# EAGLE board EPAPER73_V2 (EAGLE 9.7.0)
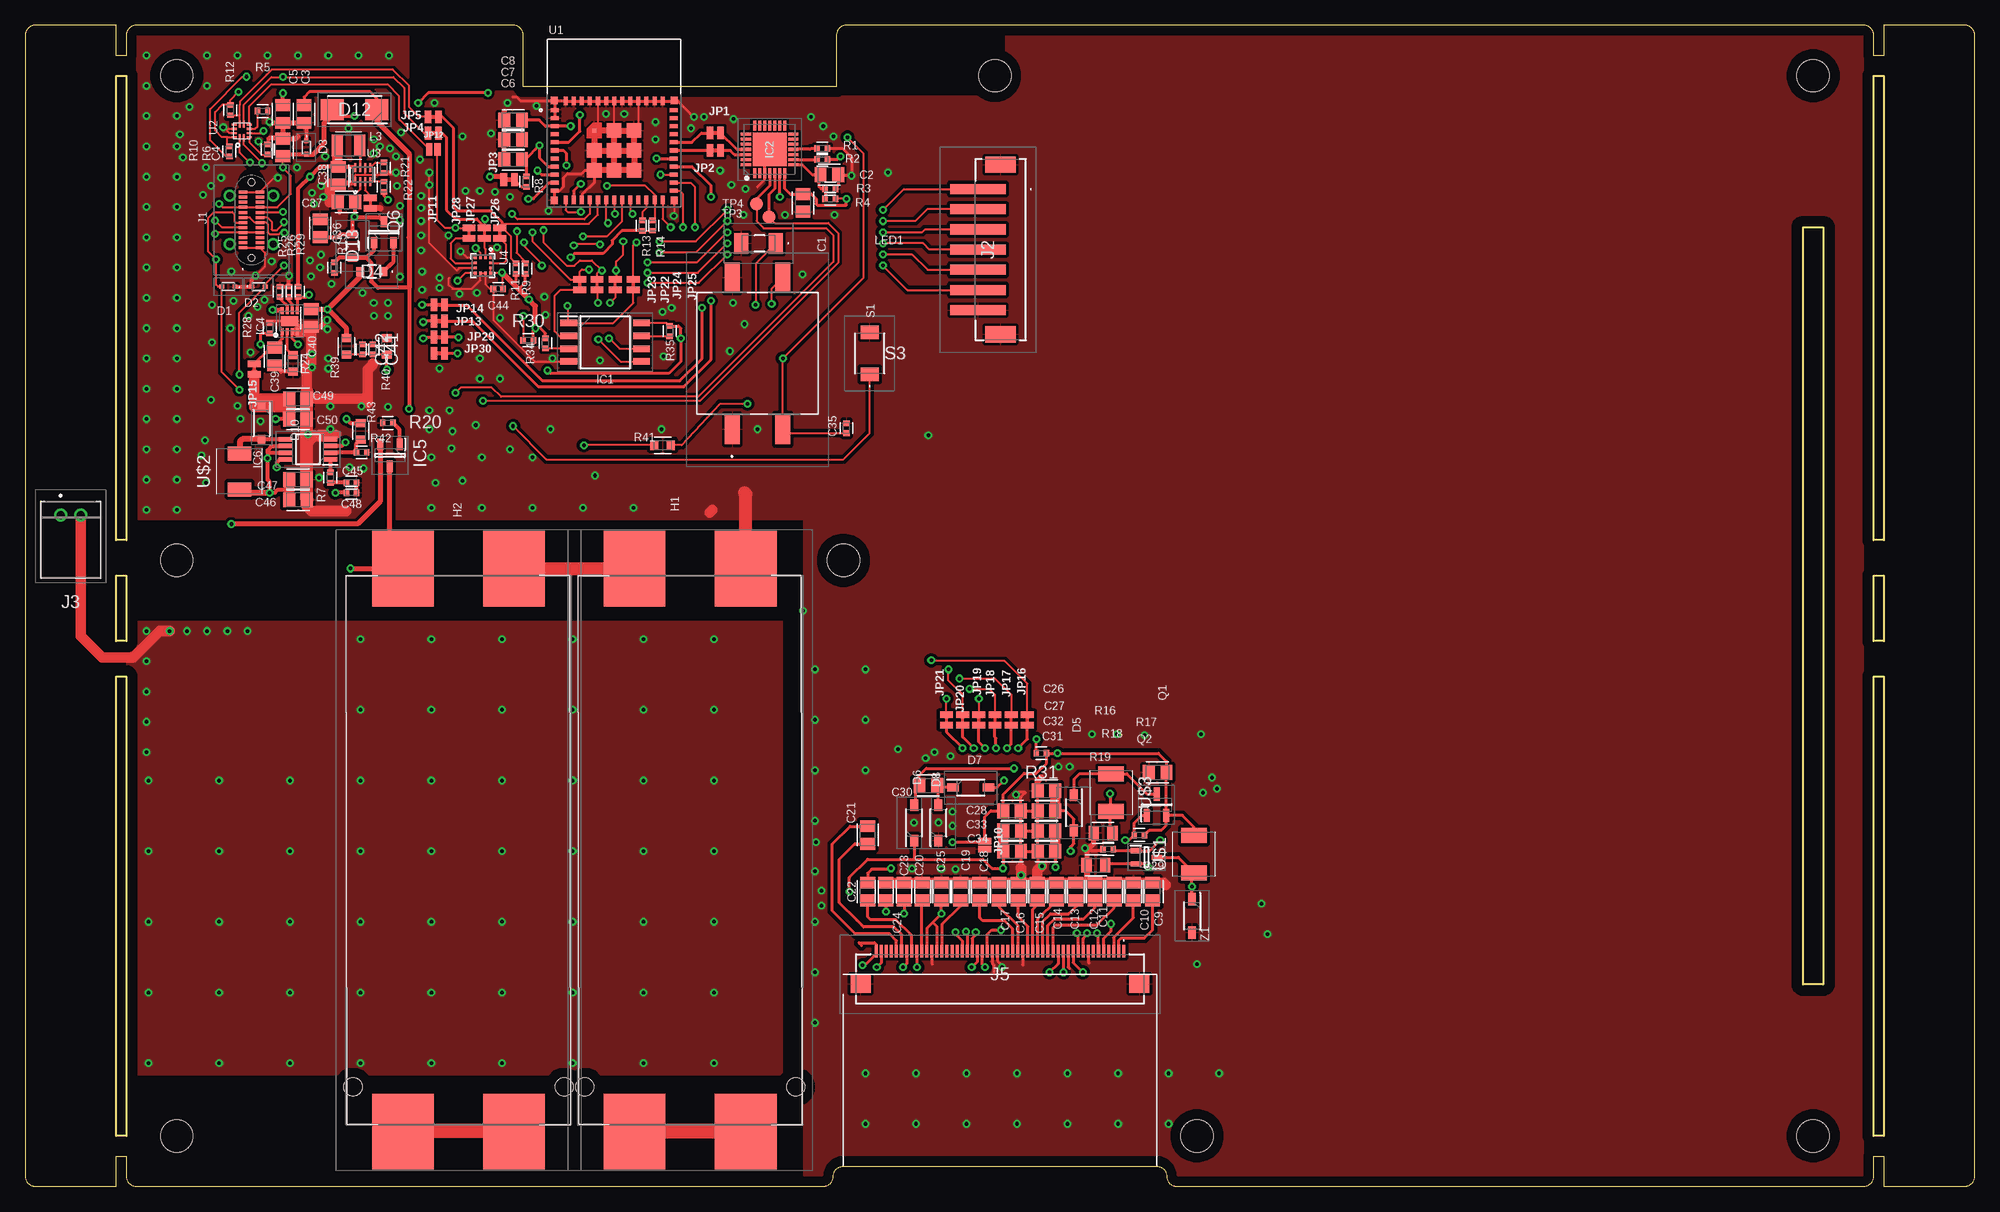
[diagram p2: board, top side]
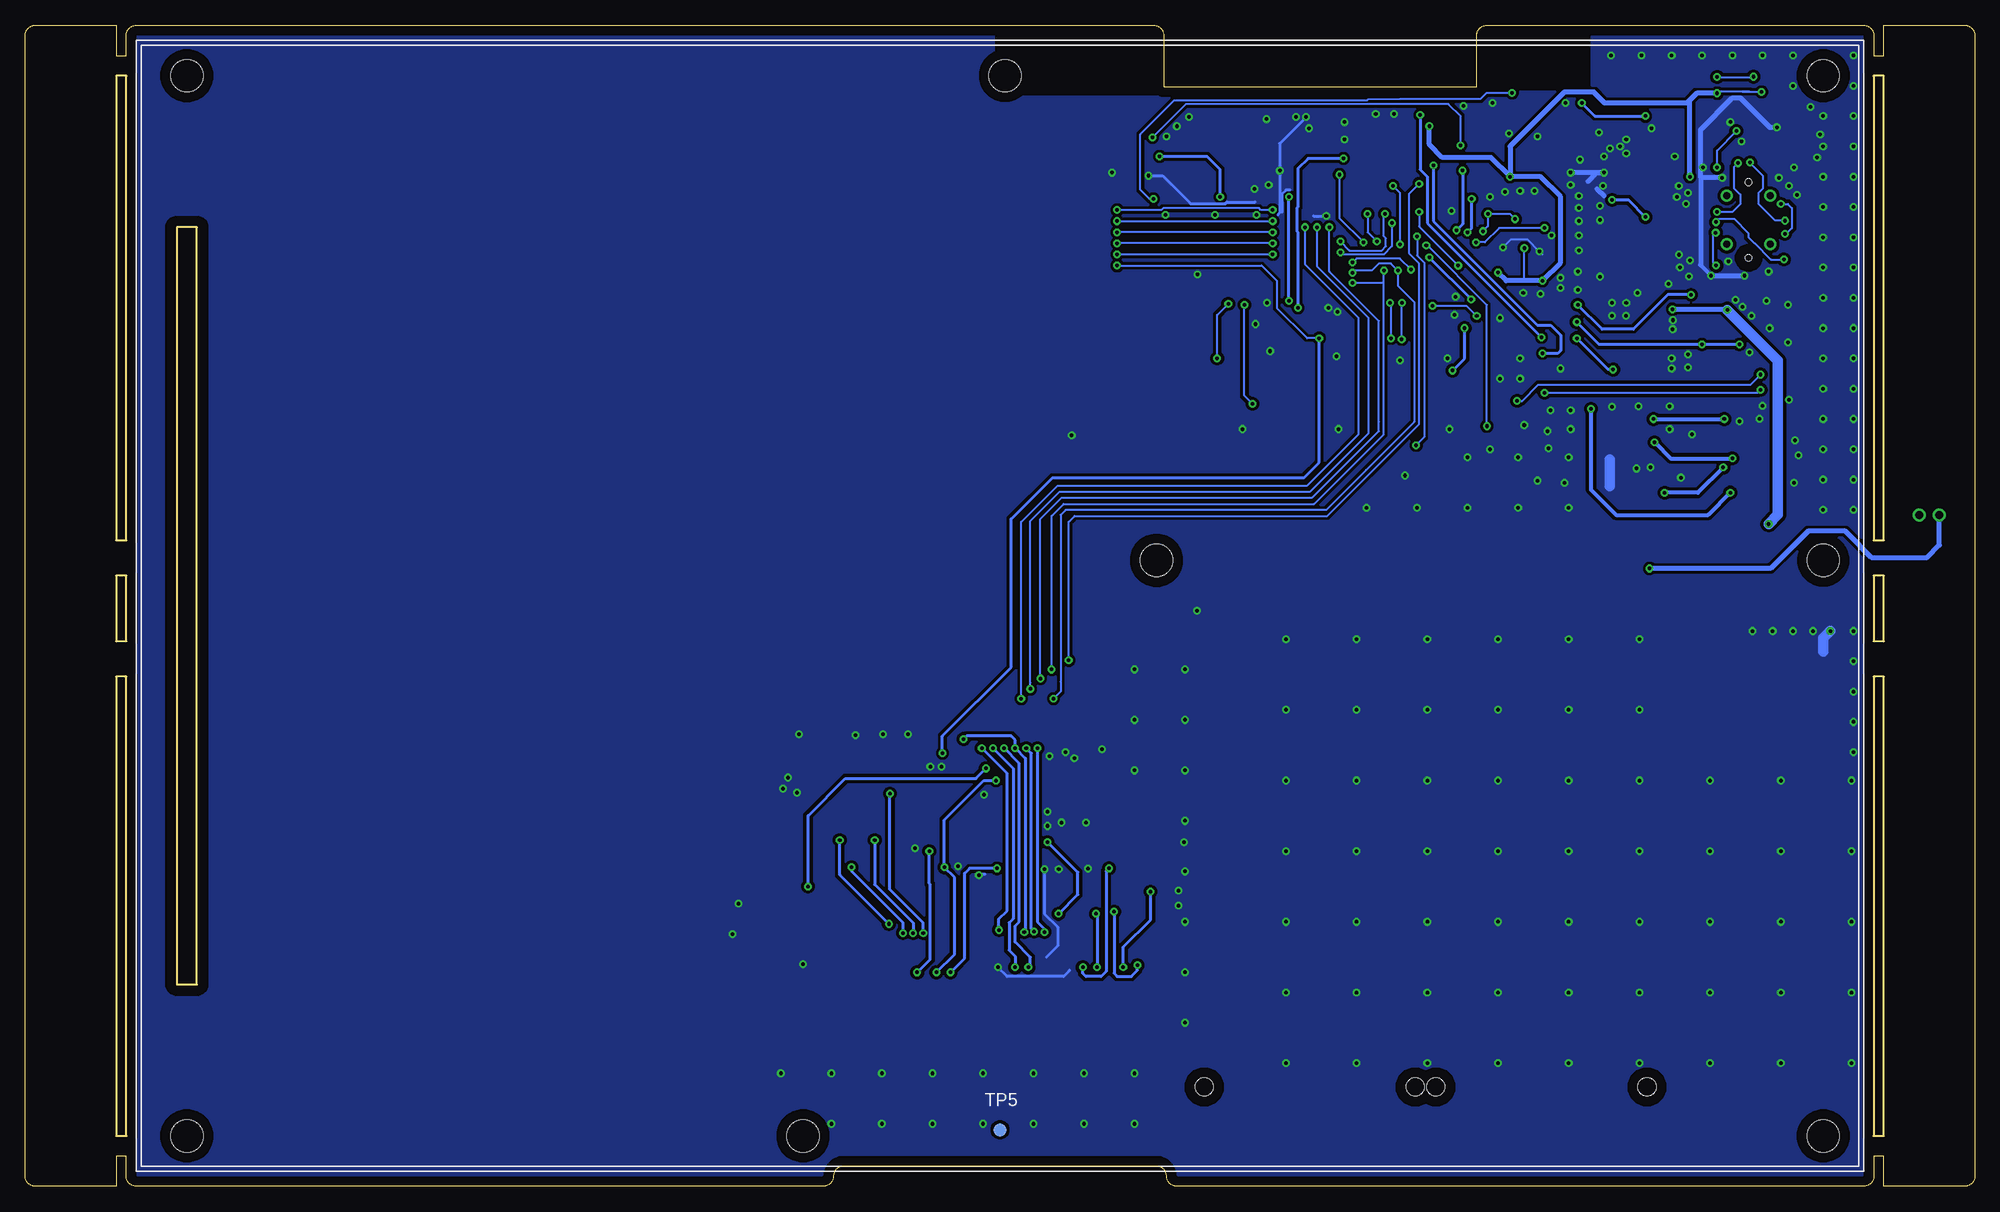
[diagram p3: board, bottom side, seen from below]

Size 193 x 115 mm. Coordinates in mm from the lower left corner, seen from the top.
Outline: 48.3,115 11,115 arc90 10,114 10,112 9,112 9,115 1,115 arc90 0,114 0,1 arc90 1,0 9,0 9,3 10,3 10,1 arc90 11,0 79,0 arc90 80,1 arc-90 81,2 112,2 arc-90 113,1 arc90 114,0 182,0 arc90 183,1 183,3 184,3 184,0 192,0 arc90 193,1 193,114 arc90 192,115 184,115 184,112 183,112 183,114 arc90 182,115 81.3,115 arc90 80.3,114 80.3,108.9 49.3,108.9 49.3,114 arc90 48.3,115
Outline: 10,110 10,64 9,64 9,110 10,110
Outline: 10,50.5 10,5 9,5 9,50.5 10,50.5
Outline: 9,54 9,60.5 10,60.5 10,54 9,54
Outline: 184,110 184,64 183,64 183,110 184,110
Outline: 184,50.5 184,5 183,5 183,50.5 184,50.5
Outline: 183,54 183,60.5 184,60.5 184,54 183,54
Outline: 178,95 178,20 176,20 176,95 178,95
Copper layers (1*16): Top / Bottom
Stack-up Default Layer Stack: Top User Defined 0.035mm / Dielectric-1 User Defined 1.5mm / Bottom User Defined 0.035mm
Design rules: minimum copper width 6mil, minimum drill size 0.35mm, copper clearance wire_polygon to wire_polygon 6mil, copper clearance wire_polygon to pad_smd 6mil, copper clearance wire_polygon to via 6mil, copper clearance pad_smd to pad_smd 6mil, copper clearance pad_smd to via 6mil, copper clearance via to via 6mil, copper clearance smd to pad (same net) 6mil, copper clearance smd to via (same net) 6mil, copper clearance smd to smd (same net) 6mil, dimension clearance 40mil, via restrict clearance 0mil, restrict clearance 0mil, drill distance 6mil, keepout clearance 0mil
Holes 3.2 mm at 15,110 15,5 177,5 177,110 81,62 116,5 96,110 15,62

## Footprints (pad centres in the part's own frame; a part is rotated, then mirrored left to right if it is on the bottom)
CAPC2012X110 = smd 1.165 x 1.465: 1 -0.875,0; 2 0.875,0
CAPC1005X60 = smd 0.56 x 0.629: 1 -0.485,0; 2 0.485,0
LESD5D50CT1G = smd 0.48 x 0.4: 1 -0.66,0; 2 0.66,0
CUS357H3F = smd 0.8 x 0.9: 1 -1.15,0; 2 1.15,0
SOD3716X135N = smd 1.15 x 0.8: 1 -1.75,0; 2 1.75,0
SODFL3516X120N = smd 0.82 x 0.76: 1 -1.6,0; 2 1.6,0
DIOM5327X244N = smd 2.3 x 2.05: 1 -2.2,0; 2 2.2,0
1078 = smd 7.45 x 6.1: 1 -27.875,-5.5; 2 -27.875,5.5; 3 27.875,-5.5; 4 27.875,5.5 | hole 1.8: -23.45,-10.45; -23.45,10.45
SOIC127P790X216-8N = smd 1.65 x 0.65: 1 -3.6,1.905; 2 -3.6,0.635; 3 -3.6,-0.635; 4 -3.6,-1.905; 5 3.6,-1.905; 6 3.6,-0.635; 7 3.6,0.635; 8 3.6,1.905
QFN50P500X500X80-29N = smd 1 x 0.3: 1 -2.35,1.5; 2 -2.35,1; 3 -2.35,0.5; 4 -2.35,0; 5 -2.35,-0.5; 6 -2.35,-1; 7 -2.35,-1.5; 15 2.35,-1.5; 16 2.35,-1; 17 2.35,-0.5; 18 2.35,0; 19 2.35,0.5; 20 2.35,1; 21 2.35,1.5 | smd 0.3 x 1: 8 -1.5,-2.35; 9 -1,-2.35; 10 -0.5,-2.35; 11 0,-2.35; 12 0.5,-2.35; 13 1,-2.35; 14 1.5,-2.35; 22 1.5,2.35; 23 1,2.35; 24 0.5,2.35; 25 0,2.35; 26 -0.5,2.35; 27 -1,2.35; 28 -1.5,2.35 | smd 3.35 x 3.35: 29 0,0
SON50P200X200X80-9N = smd 0.7 x 0.3: 1 -1.05,0.75; 2 -1.05,0.25; 3 -1.05,-0.25; 4 -1.05,-0.75; 5 1.05,-0.75; 6 1.05,-0.25; 7 1.05,0.25; 8 1.05,0.75 | smd 1 x 1.7: 9 0,0
SOT96P240X115-3N = smd 1.15 x 0.6: 1 -1.1,0.96; 2 -1.1,-0.96; 3 1.1,0
SOP65P490X110-8N = smd 1.4 x 0.45: 1 -2.2,0.975; 2 -2.2,0.325; 3 -2.2,-0.325; 4 -2.2,-0.975; 5 2.2,-0.975; 6 2.2,-0.325; 7 2.2,0.325; 8 2.2,0.975
U263241N4BQC02 = smd 0.3 x 0.85: A1 -2.75,0.835; A2 -2.25,0.835; A3 -1.75,0.835; A4 -1.25,0.835; A5 -0.75,0.835; A6 -0.25,0.835; A7 0.25,0.835; A8 0.75,0.835; A9 1.25,0.835; A10 1.75,0.835; A11 2.25,0.835; A12 2.75,0.835; B1 2.75,-0.835; B2 2.25,-0.835; B3 1.75,-0.835; B4 1.25,-0.835; B5 0.75,-0.835; B6 0.25,-0.835; B7 -0.25,-0.835; B8 -0.75,-0.835; B9 -1.25,-0.835; B10 -1.75,-0.835; B11 -2.25,-0.835; B12 -2.75,-0.835 | drill 0.7 pad 1.1: MH1 -2.4,2.15; MH2 2.4,2.15; MH3 2.4,-2.15; MH4 -2.4,-2.15 | hole 0.66: -3.75,0; 3.75,0
B7BPHSM4TBLFSN = smd 1 x 5.5: 1 6,2.75; 2 4,2.75; 3 2,2.75; 4 0,2.75; 5 -2,2.75; 6 -4,2.75; 7 -6,2.75 | smd 1.6 x 3: 8 8.4,0.5; 9 -8.4,0.5
S2BPHKS = drill 0.8 pad 1.3: 1 0,0; 2 -2,0
FPC05FB50PH20 = smd 0.3 x 1.2: 1 12.25,2.6; 2 11.75,2.6; 3 11.25,2.6; 4 10.75,2.6; 5 10.25,2.6; 6 9.75,2.6; 7 9.25,2.6; 8 8.75,2.6; 9 8.25,2.6; 10 7.75,2.6; 11 7.25,2.6; 12 6.75,2.6; 13 6.25,2.6; 14 5.75,2.6; 15 5.25,2.6; 16 4.75,2.6; 17 4.25,2.6; 18 3.75,2.6; 19 3.25,2.6; 20 2.75,2.6; 21 2.25,2.6; 22 1.75,2.6; 23 1.25,2.6; 24 0.75,2.6; 25 0.25,2.6; 26 -0.25,2.6; 27 -0.75,2.6; 28 -1.25,2.6; 29 -1.75,2.6; 30 -2.25,2.6; 31 -2.75,2.6; 32 -3.25,2.6; 33 -3.75,2.6; 34 -4.25,2.6; 35 -4.75,2.6; 36 -5.25,2.6; 37 -5.75,2.6; 38 -6.25,2.6; 39 -6.75,2.6; 40 -7.25,2.6; 41 -7.75,2.6; 42 -8.25,2.6; 43 -8.75,2.6; 44 -9.25,2.6; 45 -9.75,2.6; 46 -10.25,2.6; 47 -10.75,2.6; 48 -11.25,2.6; 49 -11.75,2.6; 50 -12.25,2.6 | smd 2 x 1.8: MP1 13.8,-0.65; MP2 -13.8,-0.65
SMT-JUMPER_2_NC_TRACE_NO-SILK = smd 0.66 x 1.27: 1 -0.521,0; 2 0.521,0
SMT-JUMPER_2_NO_NO-SILK = smd 0.635 x 1.27: 1 -0.406,0; 2 0.406,0
INDC2520X120N = smd 1.079 x 2.129: 1 -1.125,0; 2 1.125,0
KPTD3216SGC = smd 1.4 x 2: 1 -1.7,0; 2 1.7,0
SOT95P237X112-3N = smd 1.3 x 0.6: 1 -1.05,0.95; 2 -1.05,-0.95; 3 1.05,0
SOT65P210X110-3N = smd 1.05 x 0.5: 1 -1.05,0.65; 2 -1.05,-0.65; 3 1.05,0
SOT96P240X110-3N = smd 1.1 x 0.65: 1 -1.05,0.96; 2 -1.05,-0.96; 3 1.05,0
RESC1005X40 = smd 0.535 x 0.644: 1 -0.507,0; 2 0.507,0
RESC2012X65 = smd 1.031 x 1.42: 1 -0.919,0; 2 0.919,0
RESC1608X60 = smd 0.799 x 0.974: 1 -0.815,0; 2 0.815,0
TS1088AR02016 = smd 1.35 x 1.8: 1 -2.075,0; 2 2.075,0
TS1103SCU = smd 3 x 1.5: 1 -7.5,2.5; 2 7.5,2.5; 3 -7.5,-2.5; 4 7.5,-2.5
B1,27 = smd 1.27 x 1.27: TP 0,0
XCVR_ESP32-C6-MINI-1-N4 = smd 0.8 x 0.4: 1 -5.9,4; 2 -5.9,3.2; 3 -5.9,2.4; 4 -5.9,1.6; 5 -5.9,0.8; 6 -5.9,0; 7 -5.9,-0.8; 8 -5.9,-1.6; 9 -5.9,-2.4; 10 -5.9,-3.2; 11 -5.9,-4; 25 5.9,-4; 26 5.9,-3.2; 27 5.9,-2.4; 28 5.9,-1.6; 29 5.9,-0.8; 30 5.9,0; 31 5.9,0.8; 32 5.9,1.6; 33 5.9,2.4; 34 5.9,3.2; 35 5.9,4 | smd 0.4 x 0.8: 12 -4.8,-4.9; 13 -4,-4.9; 14 -3.2,-4.9; 15 -2.4,-4.9; 16 -1.6,-4.9; 17 -0.8,-4.9; 18 0,-4.9; 19 0.8,-4.9; 20 1.6,-4.9; 21 2.4,-4.9; 22 3.2,-4.9; 23 4,-4.9; 24 4.8,-4.9; 36 4.8,4.9; 37 4,4.9; 38 3.2,4.9; 39 2.4,4.9; 40 1.6,4.9; 41 0.8,4.9; 42 0,4.9; 43 -0.8,4.9; 44 -1.6,4.9; 45 -2.4,4.9; 46 -3.2,4.9; 47 -4,4.9; 48 -4.8,4.9 | smd 0.4 x 0.4: 49_1 -1.975,1.975 | smd 1.45 x 1.45: 49_2 0,1.975; 49_3 1.975,1.975; 49_4 -1.975,0; 49_5 0,0; 49_6 1.975,0; 49_7 -1.975,-1.975; 49_8 0,-1.975; 49_9 1.975,-1.975 | smd 0.7 x 0.7: 50 5.95,4.95; 51 5.95,-4.95; 52 -5.95,-4.95; 53 -5.95,4.95
X2QFN12 = smd 0.7 x 0.2: 1 -0.65,0.2; 2 -0.65,-0.2; 7 0.65,-0.2; 8 0.65,0.2 | smd 0.2 x 0.5: 3 -0.6,-0.75; 4 -0.2,-0.75; 5 0.2,-0.75; 6 0.6,-0.75; 9 0.6,0.75; 10 0.2,0.75; 11 -0.2,0.75; 12 -0.6,0.75
SON50P200X150X100-8N = smd 0.86 x 0.27: 1 -0.685,0.75; 2 -0.685,0.25; 3 -0.685,-0.25; 4 -0.685,-0.75; 5 0.685,-0.75; 6 0.685,-0.25; 7 0.685,0.25; 8 0.685,0.75
KIONIX_KXTJ3-1057 = smd 0.275 x 0.25: 1 -0.762,0.75; 2 -0.762,0.25; 3 -0.762,-0.25; 4 -0.762,-0.75; 7 0.762,-0.75; 8 0.762,-0.25; 9 0.762,0.25; 10 0.762,0.75 | smd 0.25 x 0.275: 5 -0.25,-0.762; 6 0.25,-0.762; 11 0.25,0.762; 12 -0.25,0.762
BCIHP0420SC-100M = smd 1.5 x 2.5: 1 -1.85,0; 2 1.85,0
SL0420-3R3M = smd 1.4 x 2.3: 1 -1.775,0; 2 1.775,0
SOD3716X125N = smd 1.25 x 0.75: 1 -1.65,0; 2 1.65,0

## Placement (x,y rotation side)
C1  10uF 25V 0805  [CAPC2012X110]  77,97.4 270 top
C2  1uF 25V 0805  [CAPC2012X110]  79.6,100.2 0 top
C3  10uF 25V 0805  [CAPC2012X110]  27.6,106.2 270 top
C4  4.7uF 25V 0805  [CAPC2012X110]  25.5,102.9 90 top
C5  4.7uF 25V 0805  [CAPC2012X110]  25.5,106.2 270 top
C6  1uF 25V 0805  [CAPC2012X110]  48.3,101.7 180 top
C7  100nF 50V 0805  [CAPC2012X110]  48.3,103.67 0 top
C8  10uF 25V 0805  [CAPC2012X110]  48.3,105.6 0 top
C9  4.7uF 25V 0805  [CAPC2012X110]  111.6,29.2 90 top
C10  470nF 25V 0805  [CAPC2012X110]  109.7,29.2 90 top
C11  10uF 25V 0805  [CAPC2012X110]  107.8,29.2 90 top
C12  10uF 25V 0805  [CAPC2012X110]  105.9,29.2 90 top
C13  10uF 25V 0805  [CAPC2012X110]  104,29.2 90 top
C14  10uF 25V 0805  [CAPC2012X110]  102.1,29.2 90 top
C15  10uF 25V 0805  [CAPC2012X110]  100.2,29.2 90 top
C16  10uF 25V 0805  [CAPC2012X110]  98.3,29.2 90 top
C17  1uF 50V 0805  [CAPC2012X110]  96.4,29.2 90 top
C18  1uF 50V 0805  [CAPC2012X110]  94.5,29.2 90 top
C19  2.2uF 25V 0805  [CAPC2012X110]  92.6,29.2 90 top
C20  1uF 50V 0805  [CAPC2012X110]  88.8,29.2 90 top
C21  1uF 50V 0805  [CAPC2012X110]  83.4,34.8 270 top
C22  1uF 50V 0805  [CAPC2012X110]  83.4,29.2 90 top
C23  1uF 50V 0805  [CAPC2012X110]  87,29.2 90 top
C24  470nF 50V 0805  [CAPC2012X110]  85.2,29.2 90 top
C25  100nF 50V 0805  [CAPC2012X110]  90.7,29.2 270 top
C26  10uF 50V 0805  [CAPC2012X110]  101.1,39.2 0 top
C27  100nF 50V 0805  [CAPC2012X110]  101.1,37.2 0 top
C28  4.7uF 25V 0805  [CAPC2012X110]  97.69,37.2 180 top
C29  4.7uF 25V 0805  [CAPC2012X110]  112.1,41 180 top
C30  10uF 25V 0805  [CAPC2012X110]  89.4,39.7 180 top
C31  10uF 25V 0805  [CAPC2012X110]  101.1,33.2 0 top
C32  100nF 50V 0805  [CAPC2012X110]  101.1,35.2 0 top
C33  10uF 25V 0805  [CAPC2012X110]  97.7,35.2 180 top
C34  100nF 50V 0805  [CAPC2012X110]  97.7,33.2 180 top
C35  100nF 25V 0402  [CAPC1005X60]  81.3,75.1 90 top
C36  4.7uF 25V 0805  [CAPC2012X110]  29.2,94.9 270 top
C37  4.7uF 25V 0805  [CAPC2012X110]  31.8,97.5 0 top
C38  10uF 25V 0805  [CAPC2012X110]  31,100.1 90 top
C39  1uF 25V 0805  [CAPC2012X110]  24.7,82.2 90 top
C40  1uF 25V 0805  [CAPC2012X110]  28.3,86 90 top
C41  1nF 25V 0402  [CAPC1005X60]  34.4,82.9 270 top
C42  100nF 25V 0402  [CAPC1005X60]  33.4,82.9 270 top
C44  100nF 25V 0402  [CAPC1005X60]  46.82,88.9 180 top
C45  1nF 25V 0402  [CAPC1005X60]  32.3,69.7 0 top
C46  10uF 25V 0805  [CAPC2012X110]  27,68 0 top
C47  1uF 25V 0805  [CAPC2012X110]  27,70 0 top
C48  100nF 25V 0402  [CAPC1005X60]  32.3,68.7 0 top
C49  10uF 25V 0805  [CAPC2012X110]  27,78 0 top
C50  10uF 25V 0805  [CAPC2012X110]  27,76 0 top
D1  LESD5D5.0CT1G  [LESD5D50CT1G]  20.1,89.1 180 top
D2  LESD5D5.0CT1G  [LESD5D50CT1G]  23.1,89.1 0 top
D3  LESD5D5.0CT1G  [LESD5D50CT1G]  27.8,102.9 270 top
D4  CUS08F30  [CUS357H3F]  34.3,90.6 180 top
D5  MBR0530T1G  [SOD3716X135N]  103.81,37 270 top
D6  MBR0530T1G  [SOD3716X135N]  88,36 90 top
D7  MBR0530T1G  [SOD3716X135N]  93.6,39.5 0 top
D8  MBR0530T1G  [SOD3716X135N]  90.4,36 90 top
D10  PMEG2010AEH  [SODFL3516X120N]  23.4,75.6 270 top
D12  SS34  [DIOM5327X244N]  32.6,106.64 180 top
D13  CUS08F30  [CUS357H3F]  32.4,93.15 270 top
H1  BH-AAA-B5AA001  [1078]  65.83,33.3 90 top
H2  BH-AAA-B5AA001  [1078]  42.9,33.3 90 top
IC1  W25Q128JVSIQ  [SOIC127P790X216-8N]  57.4,83.6 0 top
IC2  CP2102N-A02-GQFN28R  [QFN50P500X500X80-29N]  73.7,102.7 90 top
IC4  BQ25172DSGR  [SON50P200X200X80-9N]  26.2,85.7 90 top
IC5  DMP2035U  [SOT96P240X115-3N]  36.1,72.4 270 top
IC6  TPS61085DGKR  [SOP65P490X110-8N]  28,73 180 top
J1  U263-241N-4BQC02  [U263241N4BQC02]  22.39,95.71 90 top
J2  B7B-PH-SM4-TB_LF__SN_  [B7BPHSM4TBLFSN]  97.06,92.78 90 top
J3  S2B-PH-K-S  [S2BPHKS]  3.5,66.5 180 top
J5  FPC-05FB-50PH20  [FPC05FB50PH20]  96.5,20.7 0 top
JP1  NC  [SMT-JUMPER_2_NC_TRACE_NO-SILK]  68.3,104.33 0 top
JP2  NC  [SMT-JUMPER_2_NC_TRACE_NO-SILK]  68.3,102.6 0 top
JP3  NC  [SMT-JUMPER_2_NC_TRACE_NO-SILK]  47.9,99.7 180 top
JP4  NC  [SMT-JUMPER_2_NC_TRACE_NO-SILK]  40.4,104.3 0 top
JP5  NC  [SMT-JUMPER_2_NC_TRACE_NO-SILK]  40.4,105.92 0 top
JP10  NC  [SMT-JUMPER_2_NO_NO-SILK]  95,33.8 90 top
JP11  NC  [SMT-JUMPER_2_NC_TRACE_NO-SILK]  34.17,97.39 90 top
JP12  NC  [SMT-JUMPER_2_NO_NO-SILK]  40.4,102.7 0 top
JP13  NC  [SMT-JUMPER_2_NC_TRACE_NO-SILK]  41,85.7 0 top
JP14  NC  [SMT-JUMPER_2_NC_TRACE_NO-SILK]  41,87.3 0 top
JP15  NC  [SMT-JUMPER_2_NC_TRACE_NO-SILK]  22.67,80.93 90 top
JP16  NC  [SMT-JUMPER_2_NC_TRACE_NO-SILK]  99.2,46.2 90 top
JP17  NC  [SMT-JUMPER_2_NC_TRACE_NO-SILK]  97.6,46.2 90 top
JP18  NC  [SMT-JUMPER_2_NC_TRACE_NO-SILK]  96,46.2 90 top
JP19  NC  [SMT-JUMPER_2_NC_TRACE_NO-SILK]  94.4,46.2 90 top
JP20  NC  [SMT-JUMPER_2_NC_TRACE_NO-SILK]  92.8,46.2 90 top
JP21  NC  [SMT-JUMPER_2_NC_TRACE_NO-SILK]  91.2,46.2 90 top
JP22  NC  [SMT-JUMPER_2_NC_TRACE_NO-SILK]  56.6,89.3 90 top
JP23  NC  [SMT-JUMPER_2_NC_TRACE_NO-SILK]  54.9,89.3 90 top
JP24  NC  [SMT-JUMPER_2_NC_TRACE_NO-SILK]  58.4,89.3 90 top
JP25  NC  [SMT-JUMPER_2_NC_TRACE_NO-SILK]  60.2,89.3 90 top
JP26  NC  [SMT-JUMPER_2_NC_TRACE_NO-SILK]  46.98,94.4 90 top
JP27  NC  [SMT-JUMPER_2_NC_TRACE_NO-SILK]  45.46,94.4 90 top
JP28  NC  [SMT-JUMPER_2_NC_TRACE_NO-SILK]  43.93,94.4 90 top
JP29  NC  [SMT-JUMPER_2_NC_TRACE_NO-SILK]  41,84.1 0 top
JP30  NC  [SMT-JUMPER_2_NC_TRACE_NO-SILK]  41,82.5 180 top
L3  2.2uH/1A (20%) LQM2HPN2R2MG0L  [INDC2520X120N]  32,103.1 180 top
LED1  KPTD-3216SGC  [KPTD3216SGC]  72.6,93.4 180 top
Q1  SI2301CDS-T1-E3  [SOT95P237X112-3N]  112,37.8 90 top
Q2  SI1308EDL-T1-GE3  [SOT65P210X110-3N]  111,32.6 0 top
Q6  DMP3056L-7  [SOT96P240X110-3N]  35.5,94.5 90 top
R1  NC  [RESC1005X40]  78.9,102.8 0 top
R2  1KΩ 0402  [RESC1005X40]  78.9,101.7 0 top
R3  47KΩ 0402  [RESC1005X40]  79.7,98.8 180 top
R4  22KΩ 0402  [RESC1005X40]  79.7,97.8 180 top
R5  820KΩ 0402  [RESC1005X40]  23.5,106.5 180 top
R6  820KΩ 0402  [RESC1005X40]  24,102.7 270 top
R7  30KΩ 0402  [RESC1005X40]  30.2,70.2 90 top
R8  10KΩ 0402  [RESC1005X40]  49.6,99.5 270 top
R9  10KΩ 0402  [RESC1005X40]  49.5,90.9 90 top
R10  10KΩ 0402  [RESC1005X40]  20.2,102.5 270 top
R11  10KΩ 0402  [RESC1005X40]  48.6,90.9 90 top
R12  10KΩ 0402  [RESC1005X40]  20.3,106.6 270 top
R13  10KΩ 0402  [RESC1005X40]  61.1,95.15 90 top
R14  10KΩ 0402  [RESC1005X40]  62.1,95.16 90 top
R15  10KΩ 0402  [RESC1005X40]  30.6,91 90 top
R16  220mΩ 0805  [RESC2012X65]  106.7,35 180 top
R17  1MΩ 0402  [RESC1005X40]  110.3,34.8 0 top
R18  1MΩ 0402  [RESC1005X40]  107.2,33.42 180 top
R19  220mΩ 0805  [RESC2012X65]  106,31.8 180 top
R20  100KΩ 0402  [RESC1005X40]  35.9,75.6 180 top
R21  270kΩ 0402  [RESC1005X40]  35.5,100.9 90 top
R22  100KΩ 0402  [RESC1005X40]  35.5,99 90 top
R24  1.2KΩ 0603  [RESC1608X60]  26.5,81.5 90 top
R25  11KΩ 0402  [RESC1005X40]  25.2,88.6 270 top
R26  36KΩ 0402  [RESC1005X40]  26.1,88.6 270 top
R28  10KΩ 0402  [RESC1005X40]  24.2,85 270 top
R29  10KΩ 0402  [RESC1005X40]  27,88.6 270 top
R30  10KΩ 0402  [RESC1005X40]  49.8,83.8 0 top
R31  10KΩ 0402  [RESC1005X40]  100.6,42.9 180 top
R34  10KΩ 0402  [RESC1005X40]  51.5,83.5 90 top
R35  10KΩ 0402  [RESC1005X40]  63.8,84.7 270 top
R39  510KΩ 0603  [RESC1608X60]  31.8,83.2 270 top
R40  510KΩ 0603  [RESC1608X60]  35.8,83.2 90 top
R41  2kΩ 0603  [RESC1608X60]  63.1,73.4 0 top
R42  18KΩ 0402  [RESC1005X40]  33.3,72.7 0 top
R43  75kΩ 0603  [RESC1608X60]  33.2,74.8 270 top
S1  TS-1088-AR02016  [TS1088AR02016]  83.6,82.5 90 top
S3  TS-1103S-C-U (C318914)  [TS1103SCU]  72.5,82.5 90 top
TP3  TPB1,27  [B1,27]  73.62,96 0 top
TP4  TPB1,27  [B1,27]  72.4,97.3 0 top
TP5  EPD_PLACEHOLDER (NC)  [B1,27]  96.5,5.6 0 bottom
U1  ESP32-C6-MINI-1-N4  [XCVR_ESP32-C6-MINI-1-N4]  58.3,102.6 0 top
U2  FUSB303TMX  [X2QFN12]  21.44,104.53 90 top
U3  TPS62840DLCR  [SON50P200X150X100-8N]  33.4,100.2 90 top
U4  KXTJ3-1057  [KIONIX_KXTJ3-1057]  45.3,91.2 270 top
U$1  10uH/1A (20%)  [BCIHP0420SC-100M]  115.7,32.9 90 top
U$2  3.3uH 1.5A  [SL0420-3R3M]  21.2,70.8 90 top
U$3  10uH/1A (20%)  [BCIHP0420SC-100M]  107.5,39 270 top
Z1  BZT52C27  [SOD3716X125N]  115.5,26.8 270 top

## Tracks (layer width: path | path; a pad name or v marks a point on that pad's centre or on a via)
3V3  (via drill 0.35)
  Top 0.2: 46.06,90.45 U4.10 | 46.06,90.45 U4.11 | U4.3 45.05,92.47 v44.59,92.92 | v42.8,89.7 43.54,90.44 U4.7 | 46.06,90.45 47.15,90.45 v47.2,90.5 47.2,89 C44.1 | R13.1 61.11,94.65 R14.1 | v21.1,108.4 20.3,107.6 R12.1 19.51,107.11 18.8,106.4 18.8,104.6 19.47,103.93 20,103.93 20,103.21 R10.1
  Top 0.203: 32.56,100.97 U3.8 | 20,103.93 U2.12 | IC1.8 63.5,85.5 R35.1 63.9,85.31 | J2.6 87.32,88.78 v84.9,91.2
  Top 0.305: C25.2 v90.7,27 89.85,26.15 | 89.85,26.15 89.25,25.55 J5.40 | C28.2 97.3,37.69 | 111.25,35.24 R17.2 111.31,35.3 112.5,35.3 112.95,35.75 Q1.2 | C28.2 96.41,37.6 | C7.2 C8.2 50.9,105.6 51.5,105 U1.3 v54,105 | R11.1 48.6,89.6 48.35,89.35 | R9.1 49.5,89.5 48.85,88.85 | J5.38 90.25,25.75 89.85,26.15 | 114.85,34.25 U$1.2 115.7,35.6 114.55,36.75 Q1.2 | Q1.2 112.95,40.98 C29.1 112.97,42.1 112.17,42.9 v102.2,42.9 R31.1 101.11,41.91 100.1,40.9 98.9,40.9 96.81,38.81 C28.2 | v54,92 54.4,92.4 57.2,92.4 58.1,93.3 58.1,93.67 59.08,94.64 R13.1 | R35.1 64.69,85.21 64.9,85 v64.9,84 64.9,81.7 63.7,80.5 52,80.5 v51.7,80.8 | R30.2 50.31,84.81 v50.5,85 51,85 51.5,84.5 R34.2 | C28.2 95.6,37.2 95,36.6 JP10.2 94.89,34.1 v91.8,34.1
  Top 0.406: R29.1 27,98.8 v28.2,100 29.18,100.97 C38.2 32.56,100.97 | C5.1 v25.5,108.27
  Top 0.508: v46,100 47.08,100 JP3.2 | v47.2,90.5 48.35,89.35 48.85,88.85 v49.85,87.85 50.5,87.2 v50.5,85
  Top 1.016: L3.2 30.88,100.97 C38.2
  Bottom 0.2: 23,108.43 21.13,108.43 v21.1,108.4
  Bottom 0.203: v42.8,89.7 44.6,89.7 | 44.6,89.7 46.4,89.7 | v44.59,92.92 44.59,89.71 44.6,89.7 | v25.5,108.27 25.34,108.43 23,108.43 22.3,108.43 | v84.9,91.2 70.6,91.2 69.1,89.7 69.1,87 66.1,84 v64.9,84
  Bottom 0.305: v64.9,84 64.9,71.7 66.4,70.2 91.3,70.2 95.4,66.1 95.4,51.4 102.2,44.6 v102.2,42.9 | v54,92 v49.85,87.85 | v51.7,80.8 50.5,82 v50.5,85 | v90.7,27 88.8,28.9 88.8,31.1 v91.8,34.1
  Bottom 0.508: v46,100 47.9,101.9 52.7,101.9 54,103.2 v54,105 | v46,100 46,103 40.63,108.37 37.7,108.37 36.63,107.3 28.5,107.3 28.2,107.6 | v46,100 43,100 41,98 41,91.5 v42.8,89.7 46.4,89.7 v47.2,90.5 | v25.5,108.27 27.53,108.27 28.2,107.6 | v28.2,100 28.2,107.6
5V0  (via drill 0.35)
  Top 0.2: C4.1 v25.5,100.9 26.3,100.1 | J1.A9 J1.B4 23.76,96.96 | J1.B9 21.7,94.46 J1.A4
  Top 0.203: v81.3,97.8 R4.1 | J1.A9 19.54,96.96 v19.2,97.3 | 23.76,96.96 24.96,96.96 26.3,98.3 26.3,100.1 | v18.8,94.33 18.93,94.46 21.7,94.46 | U2.4 23.4,104.33 v23.6,104.53
  Top 0.305: IC2.7 75.2,98.8 75.72,98.28 C1.1 77.83,98.28 78.3,97.8 78.3,97.3 78.43,97.17 81.27,97.17 81.3,97.2 v81.3,97.8 | v38.9,107.3 39.9,108.3 v45.8,108.3 | v32.6,106 31.04,106 D12.2
  Top 0.406: C4.1 25.71,102.24 D3.2
  Top 0.508: D3.2 28.54,102.24 29.6,103.3 29.6,105.3 30.4,106.1 D12.2
  Bottom 0.203: v25.5,100.9 25.5,102.6 23.6,104.5 v23.6,104.53 | v81.3,97.8 81.7,97.8 82.6,98.7 82.6,104.2 79.23,107.57 60.14,107.57 60.06,107.66 56.88,107.7 48.92,107.7 48.32,108.3 v45.8,108.3 | v19.2,97.3 18.5,97.3 18.1,96.9 18.1,94.9 18.5,94.5 18.63,94.5 v18.8,94.33
  Bottom 0.305: v38.9,107.3 37.6,106 v32.6,106
+5V  (via drill 0.35)
  Top 0.305: D12.1 34.8,107.74 34.14,108.4 28.12,108.4 27.6,107.88 C3.1
  Top 0.406: 24,72.7 v24,72.1 | 24,72.7 24,72.9 24.43,73.33 IC6.6 | IC6.7 24.02,72.67 24,72.7 | IC6.3 31.32,73.33 v31.7,73.7 | 38,89.2 38,89 | 38,89 34.9,89 34.25,89.65 34.25,91.5 33.77,91.97 | 38,89 v38,77 | v24.2,68.7 | 24,71 v24,72.1 | v24,72.1 24,70 24.2,69.8 v24.2,68.7 | R15.2 31.09,92 D13.2 33.75,92 33.77,91.97 | 33.77,91.97 34.54,92.74 Q6.1 | v24.2,68.7 24.7,68.7 25,69 26.12,69
  Top 0.508: C3.1 27.82,107.3 | D12.1 34.8,105.5 38,102.3 38,93.99 38,89
  Top 0.61: U$2.1 21.52,68.7 v24.2,68.7
  Top 1.016: C47.1 26.12,69 C46.1
  Bottom 0.406: v31.7,73.7 30.1,72.1 v24,72.1 | v38,77 38,69 35.5,66.5 26.4,66.5 v24.2,68.7
+9V  (via drill 0.35)
  Top 0.305: IC4.8 25.3,86.75 25.25,86.8
  Top 0.508: v24.5,86.8 25.25,86.8 | v29.93,86.88 C40.2 28.3,87.2 | IC5.2 35.14,67.84 32.9,65.6 v20.4,65.6 | v29.93,86.88 31.8,85 R39.1 | v29.93,86.88 33.15,90.1 D4.2
  Bottom 0.508: v29.93,86.88 24.57,86.88 v24.5,86.8
  Bottom 1.016: v24.5,86.8 19.48,81.78 19.48,66.52 v20.4,65.6
ACC_INT
  Top 0.2: U4.5 42.55,91.45 42.1,91.9 42.1,93.4 42.58,93.88 JP28.1
ACC_SCL
  Top 0.2: U4.12 47.35,91.45 47.6,91.7 47.6,93.26 JP26.1
ACC_SDA
  Top 0.2: U4.2 45.55,92.85 45.45,92.94 JP27.1
CHG_EN  (via drill 0.35)
  Top 0.305: IC4.3 26.45,83.95 v27,83.4 | 23.3,83.6 v23.3,83.4 23.3,84.4 23.39,84.49 R28.2 | JP13.1 39.5,85.7 v39.4,85.6
  Bottom 0.305: v23.3,83.4 v27,83.4 37.2,83.4 v39.4,85.6
CHG_STAT  (via drill 0.35)
  Top 0.305: v28.1,88.3 27.89,88.09 R29.2 26.95,88.04 IC4.5 | JP14.1 v39.3,87.3
  Bottom 0.305: v39.3,87.3 36.9,84.9 33.8,84.9 30.4,88.3 v28.1,88.3
DISP_BUSY  (via drill 0.35)
  Top 0.305: v97.2,43.4 97.6,43.8 JP17.1 | J5.29 94.75,21.95 v95,21.7
  Bottom 0.305: v97.2,43.4 95.2,41.4 95.2,26.5 95.6,26.1 95.6,23.4 95,22.8 v95,21.7
DISP_CS  (via drill 0.35)
  Top 0.305: v95,43.4 94.4,44 JP19.1 | v100.1,44.3 R31.2 | v94.1,25.2 94.1,24.9 93.75,24.55 J5.31
  Bottom 0.305: v94.1,25.2 94,25.3 94,42.4 v95,43.4 95,44.2 95.4,44.6 99.8,44.6 v100.1,44.3
DISP_DC  (via drill 0.35)
  Top 0.305: JP18.1 96,44.5 96.1,44.4 v96.1,43.4 | J5.30 94.25,22.25 v93.7,21.7
  Bottom 0.305: v96.1,43.4 94.6,41.9 94.6,26.2 95,25.8 95,24.2 93.5,22.7 93.5,21.9 v93.7,21.7
DISP_DIN  (via drill 0.35)
  Top 0.305: v92.8,43.4 91.2,45 JP21.1 | v92.1,25.2 92.1,24.98 92.75,24.33 J5.33
  Bottom 0.305: v92.1,25.2 92.1,25.5 92.8,26.2 v92.8,43.4
DISP_GDRC  (via drill 0.35)
  Top 0.305: v108.9,34.3 109.29,34.3 R17.1 109.79,35.99 110.55,36.75 Q1.1 | v105.1,25.1 105.1,24.9 104.75,24.55 J5.9
  Bottom 0.305: v105.1,25.1 105.1,26.1 108.9,29.9 v108.9,34.3
DISP_GDRH  (via drill 0.35)
  Top 0.305: v112.36,34.3 111.31,33.25 Q2.1 107.87,33.25 R18.1 | v107.5,26 107.5,25.3 106.75,24.55 J5.5
  Bottom 0.305: v107.5,26 112.36,30.86 v112.36,34.3
DISP_RESEC  (via drill 0.35)
  Top 0.305: R16.1 107.4,35.22 107.4,36.6 107.5,36.7 U$3.2 107.4,37.25 v107.4,38.9 | J5.10 104.25,24.95 v104.1,25.1
  Bottom 0.305: v104.1,25.1 104.1,26.1 107.4,29.4 v107.4,38.9
DISP_RESEH  (via drill 0.35)
  Top 0.305: 107.3,31.8 R19.1 107.07,31.95 Q2.2 110.85,31.95 v111.2,31.6 | J5.6 106.25,24.95 v106.1,25.1
  Bottom 0.305: v106.1,25.1 106.1,26.1 111.2,31.2 v111.2,31.6
DISP_RST  (via drill 0.35)
  Top 0.305: v96.6,25.4 95.7,25.4 95.25,24.95 J5.28 | v98.3,43.4 99.2,44.3 JP16.1
  Bottom 0.305: v98.3,43.4 95.8,40.9 95.8,27.3 96.6,26.5 v96.6,25.4
DISP_SCK  (via drill 0.35)
  Top 0.305: v93.9,43.4 92.8,44.5 JP20.1 | v93.12,25.22 93.25,25.1 J5.32
  Bottom 0.305: v93.9,43.4 93.4,42.9 93.4,25.5 v93.12,25.22
DISP_VGL  (via drill 0.35)
  Top 0.305: C31.2 101.97,31.62 v102,31.6 | D7.2 96.2,39.5 v96.9,40.2 | J5.13 102.75,21.25 v102.8,21.2
  Top 1.016: C31.2 C32.2
  Bottom 0.305: v96.9,40.2 98.1,40.2 102,36.3 v102,31.6 101,30.6 101,23 v102.8,21.2
DISP_VPC  (via drill 0.35)
  Top 0.305: C27.2 103,37.2 103.81,36.39 D5.2 103.81,33.95 103.5,33.64 v103.5,33.2 | J5.11 103.75,22.15 v104.7,21.2
  Top 1.016: C27.2 C26.2
  Bottom 0.305: v103.5,33.2 103.5,30 103.42,29.92 103.42,22.48 v104.7,21.2
DISP_VPH  (via drill 0.35)
  Top 0.305: C34.2 96.8,33.17 v96.8,31.5 95.7,31.5 94.8,32.4 88,32.4 | v84.3,21.7 84.75,22.15 J5.49 | 88.15,34.1 D6.1 88,32.4 | J5.14 102.25,22.05 v101.4,21.2 | v81.6,29.2 81.6,30.6 83.4,32.4 88,32.4
  Top 1.016: C33.2 C34.2
  Bottom 0.305: v101.4,21.2 100,22.6 100,31 99.5,31.5 v96.8,31.5 | v84.3,21.7 84.3,23.7 81.6,26.4 v81.6,29.2
ESP_ADC0  (via drill 0.35)
  Top 0.305: v42.9,84.1 JP29.2 | v54.9,106.1 54.9,104.5 53.8,103.4 U1.5
  Bottom 0.305: v54.9,106.1 54.9,100.7 54.2,100 54.2,95.4 v42.9,84.1
ESP_ADC1  (via drill 0.35)
  Top 0.305: v53.6,101.1 53.6,102.3 53.3,102.6 U1.6 | v42.8,82.5 JP30.1
  Bottom 0.305: v53.6,101.1 53.6,95.6 43.3,85.3 42,85.3 41,84.3 41,82.8 41.3,82.5 v42.8,82.5
ESP_CLK  (via drill 0.35)
  Top 0.2: v58.5,90.7 58.5,91.6 59.2,92.3 v59.2,93.6 | v60.1,96.3 59.9,96.5 U1.20
  Top 0.203: v58.5,90.7 58.5,89.92 JP24.2 | v91.4,51.2 91.4,50.1 92.8,48.7 JP20.2 | v61.6,89.5 66.7,89.5 v69.5,92.3 | v84.91,92.3 87.81,92.3 89.33,90.78 J2.5
  Bottom 0.2: v59.2,93.6 60.1,94.5 v60.1,96.3 | v91.4,51.2 91.4,66.4 90.2,67.6 65.4,67.6 58.53,74.47 58.53,82
  Bottom 0.203: v58.5,90.7 58.53,90.67 58.53,89.5 | 58.53,82 58.53,89.5 | v61.6,89.5 58.53,89.5 | v69.5,92.3 v84.91,92.3
ESP_CS0  (via drill 0.35)
  Top 0.203: U1.26 65.9,99.4 66.3,99 v66.3,95 | v94.4,48.3 JP19.2
  Bottom 0.2: 94.4,49 94.4,65.8 90.8,69.4 66.1,69.4 61,74.5
  Bottom 0.203: v66.3,95 66.3,91.3 61,86 61,74.5 | v94.4,48.3 94.4,49
ESP_CS1  (via drill 0.35)
  Top 0.2: JP25.2 60.2,93.2 v60.5,93.5 | v62.9,100.2 U1.27
  Bottom 0.2: v60.5,93.5 62.9,95.9 v62.9,100.2
ESP_DL  (via drill 0.35)
  Top 0.2: R14.2 62.3,95.87 U1.23
  Top 0.203: v57.6,99.1 61.4,99.1 62.3,98.2 U1.23 | v56.9,93.3 54.4,93.3 v54.3,93.2 | v48.3,75.3 51.6,72 81,72 83.6,74.6 S1.1
  Bottom 0.203: v57.6,99.1 56.9,98.4 v56.9,93.3 | v48.3,75.3 48.3,87.3 54.2,93.2 v54.3,93.2
ESP_EN  (via drill 0.35)
  Top 0.2: v81.4,103.9 83,102.3 83,96 83,90 v75,82 S3.3 75.39,74.61 C35.1 | v73.9,87.4 73.9,88.9 S3.4
  Top 0.305: 50.51,102.71 v50.9,103.1 | v50.9,103.1 49.5,101.7 C6.1 49.6,101.28 R8.1 | U1.8 51.8,101 50.9,101.9 v50.9,103.1
  Bottom 0.2: v81.4,103.9 78.1,107.2 52.1,107.2 50.9,106 v50.9,103.1 | v75,82 75,86.3 v73.9,87.4
ESP_INT  (via drill 0.35)
  Top 0.2: v42.6,94.92 JP28.2 | U1.12 53.5,96.7 53.7,96.5 v55,96.5
  Top 0.203: JP12.2 40.81,95.69 41.58,94.92 v42.6,94.92 | v49.37,93.5 49.37,93.16 51.14,91.39 v51.14,91.19
  Bottom 0.2: v55,96.5 55,95.06 v51.14,91.19
  Bottom 0.203: v42.6,94.92 47.08,94.92 48.5,93.5 v49.37,93.5
ESP_MISO  (via drill 0.35)
  Top 0.203: v50.2,94.5 50.2,93.6 53.98,89.82 JP23.2 54.9,90.6 55.1,90.8 v55.8,90.8 | v61.6,91.5 66.5,91.5 v69.5,94.5 | v84.9,94.5 88.8,94.5 89.08,94.78 J2.3
  Top 0.305: U1.10 51.9,99.4 50.3,97.8 v49.8,97.8
  Bottom 0.203: v55.8,90.8 56.9,91.9 61.2,91.9 v61.6,91.5 | v69.5,94.5 v84.9,94.5
  Bottom 0.305: v49.8,97.8 49.8,94.9 v50.2,94.5
ESP_MOSI  (via drill 0.35)
  Top 0.203: JP22.2 56.6,90.42 56.88,90.7 v57.1,90.7 56.1,91.7 54.9,91.7 54.37,91.17 53.63,91.17 51.3,93.5 v51.3,94.7 | JP21.2 v91.2,48.3 | v61.6,90.49 66.59,90.49 v69.5,93.4 | J2.4 89.52,92.78 88.9,93.4 v84.9,93.4
  Top 0.305: U1.9 51.1,100.2 v50.7,100.6
  Bottom 0.2: 90.5,50 90.5,66.5 90,67 64.2,67 60.25,70.95
  Bottom 0.203: 90.5,50 90.5,49 v91.2,48.3 | 60.25,70.95 55.5,75.7 55.5,87.6 57.1,89.2 v57.1,90.7 57.8,91.4 59,91.4 59.7,90.7 61.39,90.7 v61.6,90.49 | v69.5,93.4 v84.9,93.4
  Bottom 0.305: v51.3,94.7 50.7,95.3 v50.7,100.6
ESP_P0  (via drill 0.35)
  Top 0.2: v55.2,94.1 57.6,94.1 59.1,95.6 U1.19
  Top 0.203: R41.1 v55.3,73.4
  Bottom 0.2: 55,92 55.2,92.2 v55.2,94.1
  Bottom 0.203: 55,92 54.5,91.5 54.5,74.2 v55.3,73.4
ESP_P1  (via drill 0.35)
  Top 0.203: JP16.2 99.2,49.8 96.97,52.03 89.77,52.03 v89.7,52.1
  Top 0.305: U1.13 54.3,98.6 v55,99.3
  Bottom 0.2: v89.7,52.1 89.7,65.8 89.1,66.4 64.1,66.4 63.35,67.15
  Bottom 0.203: v55,99.3 56,98.3 56,92.4 55,91.4 55,75.5 63.35,67.15
ESP_P12  (via drill 0.35)
  Top 0.2: U1.17 57.5,95.6 v57.7,95.4 | v62.8,92.5 66.4,92.5 v69.5,95.6
  Top 0.203: v84.9,95.6 88.1,95.6 89.28,96.78 J2.2
  Bottom 0.2: v57.7,95.4 57.7,93.1 58.5,92.3 62.6,92.3 v62.8,92.5 | v84.9,95.6 v69.5,95.6
ESP_P13  (via drill 0.35)
  Top 0.2: 58.3,97.43 U1.18 58.3,96.4 v58.4,96.3 | v62.8,93.6 66.4,93.6 v69.5,96.7
  Top 0.203: v84.9,96.7 86.98,98.78 J2.1
  Bottom 0.2: v58.4,96.3 58.5,96.2 58.5,94.1 58.3,93.9 58.3,93.1 58.7,92.7 61.9,92.7 v62.8,93.6 | v69.5,96.7 70.68,96.7 70.84,96.86 80.36,96.86 80.52,96.7 v84.9,96.7
ESP_P18  (via drill 0.35)
  Top 0.203: U1.24 63.1,95.8 v63.9,95 | v92.5,50.3 96,50.3 97.6,48.7 JP17.2
  Bottom 0.2: 92.5,50 92.5,66.1 90.4,68.2 65.6,68.2 59,74.8 59,75.7
  Bottom 0.203: v63.9,95 63.9,90.6 59,85.7 59,75.7 | v92.5,50.3 92.5,50
ESP_P19  (via drill 0.35)
  Top 0.203: v65.1,95 65.1,98.3 64.8,98.6 U1.25 | JP18.2 96,48.7 95.43,49.27 v93.5,49.27
  Bottom 0.2: 93.5,49.89 93.5,65.9 90.6,68.8 65.8,68.8 60,74.6 60,74.8
  Bottom 0.203: v65.1,95 65.1,91.1 60,86 60,74.8 | v93.5,49.27 93.5,49.89
ESP_P22  (via drill 0.35)
  Top 0.305: JP13.2 44.3,85.7 50.8,79.2 65.2,79.2 67.9,81.9 v67.9,87.7 | U1.28 66,101 67.9,99.1 v67.9,98
  Bottom 0.305: v67.9,87.7 v67.9,98
ESP_P23  (via drill 0.35)
  Top 0.305: JP14.2 43.7,87.3 51.2,79.8 64.8,79.8 67,82 v67,87 | v62.5,101.8 U1.29
  Bottom 0.305: v62.5,101.8 66,101.8 67,100.8 67,97 67.1,96.9 67.1,94.6 67,94.5 v67,87
ESP_SCL
  Top 0.2: JP26.2 47.39,95.33 55.8,95.33 56.7,96.23 U1.16
  Top 0.203: JP26.2 47.26,94.92 48.08,94.1 48.08,91.93 R11.2
  Top 0.305: JP5.2 41.28,105.92 42.4,104.8 42.4,97 42.8,96.6 46.1,96.6 47.2,95.5 47.2,95.14 JP26.2
ESP_SDA  (via drill 0.35)
  Top 0.2: v45.5,95.8 45.5,94.97 JP27.2 | U1.15 55.9,96.33 55.35,95.78 48.72,95.78 v48.2,96.3
  Top 0.203: R9.2 49.5,91.6 48.64,92.46 48.64,94.54 v48.7,94.6
  Top 0.305: JP4.2 41.3,104.3 41.7,103.9 41.7,96.7 42.6,95.8 44.7,95.8 45.45,95.05 JP27.2
  Bottom 0.2: v48.2,96.3 46,96.3 v45.5,95.8
  Bottom 0.203: v48.7,94.6 48.2,95.1 v48.2,96.3
GND  (via drill 0.35)
  Top 0.2: J1.A1 J1.B12 23.7,92.48 23.7,91.1 v22.8,90.2 | J1.B1 24.66,99.9 v25,99.9 | C44.2 46,88.9 45.55,89.35 U4.9 U4.8 45.05,89.75 44.2,88.9 42.3,88.9 41.9,89.3 41.9,89.9 42,90 | U4.1 46.05,92.35 v46.7,93 | U4.4 43.74,91.96 v43.1,92.6 | U4.6 42.95,90.95 42.7,90.7 | R6.1 24,103.8 | U2.11 20.2,104.33 19.8,104.73 | C42.1 C41.1
  Top 0.203: 31,99.3 32.44,99.3 32.52,99.38 32.57,99.43 U3.1 32.65,100.15 32.7,100.2 33.6,100.2 | R21.1 35.31,100.2 33.6,100.2 | U3.6 33.65,100.25 33.6,100.2 | U2.10 19.8,104.73 19.43,104.73 v19.6,104.9 | 42.7,90.7 40,93.4 v40,99.2 v40,100.4 | U1.49_2 U1.42 | U1.39 60.7,105 U1.49_3 | U1.44 56.7,104.58 | U1.51 64.25,96.15 v64.2,96.1 | J1.A12 J1.B1 | C44.2 46.34,85.81 50.45,81.69 IC1.4 | 73,62.02 72.15,61.17 H1.3
  Top 0.305: IC4.9 | IC4.9 24.4,85.71 R28.1 | 26.95,85.3 IC4.4 | 26.95,85.3 26.95,85.65 26.89,85.71 IC4.9 | C40.1 28.17,85.3 26.95,85.3 | C20.2 88.3,30.57 | 106.49,30.27 106.3,30.07 | 92.1,30.07 92,30.18 | R3.1 80.21,98.91 80.5,99.2 80.5,100.17 | 80.5,100.17 C2.2 | 80.5,100.17 80.58,100.1 v81.8,100.1 81.8,101.9 80.9,102.8 R1.2 | IC2.29 73.2,102.2 IC2.3 73.2,99.7 72.5,99 | C8.1 47.42,105.72 | U1.53 52.4,107.5 U1.1 U1.2 | U1.53 53.45,107.55 U1.48 U1.47 U1.46 U1.45 U1.44 U1.43 U1.42 U1.41 U1.40 U1.39 U1.38 U1.37 U1.36 64.2,107.5 U1.50 64.55,107.55 v66.2,105.9 | U1.52 52.35,98.55 U1.11 52.9,98.6 53.3,99 53.3,99.9 53.7,100.3 55.1,100.3 55.42,100.62 U1.49_7 56.33,99.42 55.1,98.2 U1.14 | C39.1 25.09,80.93 | R18.2 106.56,33.28 105.08,33.28 | J5.27 95.75,22.05 95.9,21.9 95.9,21.2 | J5.39 89.75,22.05 89.8,22 | J5.21 98.75,21.95 98.8,21.9 | J5.8 105.25,22.15 105.3,22.1 | 48.28,107.92 48.63,107.92 49,107.55 U1.53 | C9.2 113.23,30.07 113.3,30 | J5.26 96.25,22.35 96.7,21.9 v96.7,21.7 | J5.12 103.25,21.72 103.38,21.58 | C34.1 C33.1 C32.1 | 98.56,35.22 C28.1 | C31.1 C32.1 | C32.1 C27.1 | C28.1 C27.1 | C34.1 C31.1 | C34.1 98.58,31.52 | C31.1 100.22,31.31 100.2,31.28 | C27.1 C26.1 | C28.1 98.56,38.56 99,39 98.3,39 v98.1,38.8
  Top 0.406: IC6.4 29.02,73.97 27.88,75.12 C50.2 | C45.2 C48.2 | 33.78,72.68 R42.2 | R25.1 R26.1 v26.1,90.2 | 32.57,99.43 31.21,99.43 C38.1 31.16,99.38 32.52,99.38 | C3.2 27.8,105.12 D3.1 | D1.1 D2.1 22.44,89.84 v22.8,90.2 | C37.1 31.12,97.3 31.12,96.42 | R24.1 25.34,80.69 C39.1 | 27.66,80.96 27.88,81.17
  Top 0.508: R21.1 v36.69,100.39 v36.7,100.4 | C5.2 C3.2 | C5.2 C4.2 | 24.01,105.59 24.3,105.3 25.48,105.3 C5.2 | 24.2,103.8 25.48,103.8 C4.2 | 47.23,101.9 C6.2 C7.1 C8.1 47.42,106.53 | R19.2 105.08,33.28 105.78,33.98 R16.2 | C4.2 26.77,103.78 27,104 | C40.1 29.19,85.12 29.97,85.9
  Top 0.61: U1.49_2 U1.49_3 U1.49_6 | U1.49_2 56.7,104.58 U1.49_1 U1.49_4 | U1.49_4 U1.49_5 | U1.49_5 U1.49_2 | U1.49_5 U1.49_6 | U1.49_6 U1.49_9 U1.49_8 | U1.49_8 U1.49_7 U1.49_4 | U1.49_8 U1.49_5 | R19.2 105.08,30.09 105.1,30.07 | 35.15,96.87 JP11.1 | C26.1 100.22,40.16 100.58,40.52
  Top 0.813: 27.88,74 28.38,74.5 28.98,74.5 | 30.9,74.5 28.98,74.5 | 28.98,74.5 27.88,73.4
  Top 1.016: 27.88,73.4 27.88,71 | 27.88,71 C47.2 C46.2 27.88,67.33 28.3,66.9 31.8,66.9 | C50.2 27.88,74 | C50.2 C49.2 | C49.2 33.5,78 | 27.88,71 C50.2 | C49.2 27.88,81.17 28.3,81.6 28.3,84.5 | 28.3,84.5 C40.1 | IC4.4 28.15,84.65 28.3,84.5 | C38.1 31,99.3 30.12,99.3 30.12,97.5 C37.1 | C16.2 C17.2 C18.2 C19.2 92.1,30.07 C25.1 C20.2 C23.2 C24.2 | C16.2 C15.2 | C15.2 C14.2 C13.2 105.1,30.07 C12.2 106.3,30.07 C11.2 C10.2 C9.2 112.72,30.07 112.92,29.88 | C33.1 98.56,35.22 | 100.22,30.1 C15.2 | 98.58,31.52 98.6,31.5 v98.6,30.82 98.6,30.38 C16.2 | J3.2 5.5,54.5 7.62,52.38 10.67,52.38 13.3,55 v14.3,55 | 67.75,66.75 68,67 | 33.9,77.6 33.9,80.89 34.42,81.41 34.42,81.47 | C15.2 100.2,31.28 v100.64,31.72
  Top 1.27: C46.2 27.88,78.67 27.9,78.7 | H1.3 71.33,68.57 71.2,68.7
  Bottom 0.2: v46.7,93 45.9,93.8 44.3,93.8 v43.1,92.6 42.8,92.31
  Bottom 0.305: 91.9,22.7 90.8,23.8 90.8,25.7 92.1,27 v92.1,31.4 | v81.8,100.1 80.4,100.1 77.62,97.32 74.18,97.32 74.02,97.48 71.25,97.48 | 65.45,96.1 v64.2,96.1 | 67.81,98.68 68.18,98.68 68.58,98.28 68.58,96.52 | 69,96.23 68.82,96.42 68.82,103.28 v66.2,105.9 | v96.7,21.7 95.8,20.8 90.2,20.8 89.6,21.4 | 98.01,30.91 98.51,30.91 v98.6,30.82
  Bottom 0.406: 27.15,91.25 v26.1,90.2
  Bottom 0.508: 27.15,100 27.15,104.65 24,107.8 23.2,107.8 20.3,104.9 v19.6,104.9 | 27.15,100 27.15,91.25 | v26.1,90.2 v22.8,90.2 | v25,99.9 27.05,99.9 27.15,100 | v40,100.4 v36.7,100.4 37.41,100.4 38.28,99.53 | 37.38,98.78 36.7,98.1
  Bottom 1.016: v14.3,55 15,54.3 15,53 | 36.14,69.36 36.14,71.96
  other vias: 48,73 41,81 47,80 45,80 45,82 41,89 47,86 64,87 46.5,98.5 67.2,105.9 70.1,105.7 79,105 80,104 68.8,100.6 15.3,104.2 35.1,103 36.7,102 37.1,95.7 29.7,102 20.6,87.7 20.4,90.6 19.4,99.9 37.2,104.4 42.3,74.8 35.9,77.2 44.6,75.4 43.3,69.9 42.2,73.1 32.1,71.2 40.6,69.7 33.5,71.1 28,74.5 18.5,83.6 18.4,77.9 18.5,87.3 18.4,99.1 37.1,97.1 36.1,102.8 34.5,102.3 34.5,103.7 39.2,98.1 39.2,96.9 39.2,95.6 39.2,94.2 39.2,92.7 39.09,101.69 41,90 41.9,94.2 43,88.4 44.7,88.5 43.3,104 40.5,107.3 40,75 37.1,90.1 30.3,89.4 29.3,99.1 23.3,75.77 33.3,77.27 30.2,77.27 40,76.87 42,76.87 29.5,98 28.6,97.3 33.4,88.5 35.9,86.2 39.3,88.8 39.3,90.6 17.9,100.9 17.6,98.2 17.9,69.7 17.8,73.9 23,87.1 20.3,85 24.4,91.6 71.2,85.4 65.9,104.8 77.8,105.9 63.1,86.6 56.9,81.8 62.4,103.7 62.4,105.4 46.1,104.3 59.3,106.2 57.5,106.2 71.3,98.8 69.9,99.2 28.4,81.1 28.4,82.4 43.6,98.6 48,98 45,98.6 51.8,96.6 63.2,82.2 77,57 116,22 123,25 78.3,34.1 104.9,33.5 110.8,44.7 63,75 52,75 56.4,70.4 22.1,86.2 23.7,87.8 29.9,84.9 22.3,82.6 30.2,75 29.1,70.2 26.9,100.9 23.1,103.5 24.2,105.4 69.75,82.72 16,55 18,55 20,55 22,55 12,55 12,52 12,49 12,46 12,43 47.75,107.3 50.6,107 72.5,75 51.5,86.3 52.2,82 15.59,101.9 16.27,106.9 89.4,74.4 85.4,100.4 116.4,44.8 21.3,76.01 21.02,77.3 17.44,72.4 122.41,28 51.38,88.12 71.1,96.23 75.2,96.23 80.1,96.23 70.08,87.5 76.93,90.32 34.53,86.23 29.9,85.8 30,81 30,82 35.9,87.5 34.5,87.5 29.2,91 28.2,91.7 28.4,98.4 36.8,99.1 32,104.8 28.3,90.14 29.28,92.28 78.82,27.8 78.82,29.3 87.8,31.48 103.4,41.58 117.5,40.5 116.6,39 118,39.4 91.6,42.6 91.8,35.7 86.4,43.3 105.6,44.78 108.1,44.78 102.3,41.58 89.14,42.4 88,36.02 90.68,31.42 90.03,42.99 90.4,36.04 91.79,37.11 83.2,51.2 78.2,51.2 83.2,46.2 78.2,46.2 83.2,41.2 78.2,41.2 78.2,36.2 78.2,31.2 78.2,26.2 78.2,21.2 78.2,16.2 118.2,11.2 113.2,11.2 108.2,11.2 103.2,11.2 98.2,11.2 93.2,11.2 88.2,11.2 83.2,11.2 83.2,6.2 88.2,6.2 93.2,6.2 98.2,6.2 103.2,6.2 108.2,6.2 113.2,6.2 50.2,72.2 45.2,72.2 40.2,72.2 40.2,67.2 45.2,67.2 50.2,67.2 55.2,67.2 60.2,67.2 36,112 33,112 30,112 27,112 24,112 21,112 18,112 12,112 18,109 12,109 15,106 12,106 15,103 12,103 15,100 12,100 15,97 12,97 15,94 12,94 15,91 12,91 15,88 12,88 15,85 12,85 15,82 12,82 15,79 12,79 12,67 15,67 12,70 15,70 12,73 15,73 12,76 15,76 68.2,54.2 61.2,54.2 54.2,54.2 47.2,54.2 40.2,54.2 33.2,54.2 68.2,47.2 61.2,47.2 54.2,47.2 47.2,47.2 40.2,47.2 33.2,47.2 68.2,40.2 61.2,40.2 54.2,40.2 47.2,40.2 40.2,40.2 33.2,40.2 26.2,40.2 19.2,40.2 12.2,40.2 68.2,33.2 61.2,33.2 54.2,33.2 47.2,33.2 40.2,33.2 33.2,33.2 26.2,33.2 19.2,33.2 12.2,33.2 68.2,26.2 61.2,26.2 54.2,26.2 47.2,26.2 40.2,26.2 33.2,26.2 26.2,26.2 19.2,26.2 12.2,26.2 68.2,19.2 61.2,19.2 54.2,19.2 47.2,19.2 40.2,19.2 33.2,19.2 26.2,19.2 19.2,19.2 12.2,19.2 68.2,12.2 12.2,12.2 19.2,12.2 26.2,12.2 33.2,12.2 40.2,12.2 47.2,12.2 54.2,12.2 61.2,12.2
  pour Bottom (isolate 0.305): 11,120 11,-3 182,-3 182,120 97,120.99 97,108 66,108 66,120 51,120 51,108.5 38,108.5 38,120
  pour Top (isolate 0.305): 182,-4 182,122 97,122 97,108 66,108 66,121 51.1,121 51.1,108.5 38,108.5 38,121 11,121 11,66 77,66 77,-4
  pour Top: 75,56 10,56 10,11 75,11
  pour Top (no thermals): 26.8,84.2 29.8,84.2 29.8,85.9 26.8,85.9
  pour Top (no thermals): 25.6,86.2 23.6,86.2 23.6,85.2 25.6,85.2
MEM_CLK  (via drill 0.35)
  Top 0.203: IC1.6 58.84,82.97 v57.8,84 | v57.9,87.5 58.4,88 JP24.1
  Bottom 0.203: v57.8,84 57.8,87.4 v57.9,87.5
MEM_CS  (via drill 0.35)
  Top 0.203: JP25.1 60.2,87.5 58.2,85.5 IC1.1 53.7,85.61 v53.7,87.2 | R30.1 v49.29,86.19 v49.3,86.2
  Bottom 0.203: v49.3,86.2 50.3,87.2 v53.7,87.2
MEM_DI  (via drill 0.35)
  Top 0.203: JP22.1 56.7,88.68 v56.7,87.5 | IC1.5 58.94,81.69 v56.73,83.9
  Bottom 0.203: v56.7,87.5 56.73,87.47 v56.73,83.9
MEM_DO
  Top 0.2: 52.87,84.23 52.4,84.7 52.4,88.2 52.8,88.6
  Top 0.203: IC1.2 52.87,84.23 52.72,84.38 | JP23.1 54.88,88.8 53,88.8 52.8,88.6 52.72,88.52
N$1
  Top 0.305: U1.31 66,103.4 66.93,104.33 JP1.1
N$2
  Top 0.305: JP2.1 U1.30
N$3
  Top 0.305: JP1.2 70.45,102.7 IC2.25
N$4
  Top 0.305: IC2.26 70.2,102.2 69.8,102.6 JP2.2
N$5
  Top 0.305: IC2.9 R2.1
N$6
  Top 0.305: IC2.11 77.7,102.7 77.8,102.8 R1.1
N$7
  Top 0.305: IC2.8 76.9,101.2 77.9,100.2 C2.1 78.6,100.08 78.6,99 78.8,98.8 R3.2 R4.2
N$10
  Top 0.203: R5.2 22.99,104.99 22.73,104.73 U2.5
N$11  (via drill 0.35)
  Top 0.305: v74.7,98 IC2.6 | v80.7,102 80.4,101.7 R2.2
  Bottom 0.305: v74.7,98 74.7,100.7 76,102 v80.7,102
N$12
  Top 0.2: R6.2 23.4,102.2 22.19,103.41 U2.3
N$14
  Top 0.305: R8.2 49.13,98.99 JP3.1
N$15
  Top 0.305: C9.1 111.6,25.4 110.8,24.6 108.5,24.6 108.25,24.35 J5.2
N$16
  Top 0.203: U1.22 61.5,96.9 61.1,96.5 R13.2
N$18
  Top 0.305: C11.1 107.8,27.6 106.1,25.9 102,25.9 101.75,25.65 J5.15
N$19
  Top 0.305: C12.1 105.9,27.6 104.8,26.5 101.9,26.5 101.25,25.85 J5.16
N$20
  Top 0.305: C13.1 104,27.7 103.3,27 101.5,27 100.75,26.25 J5.17
N$21
  Top 0.305: C14.1 100.25,26.48 J5.18
N$22
  Top 0.305: C15.1 100.2,27.9 99.75,27.45 J5.19
N$23
  Top 0.305: C16.1 98.3,26.7 99.25,25.75 J5.20
N$24
  Top 0.305: J5.37 90.75,25.95 92.6,27.8 C19.1
N$25
  Top 0.305: C17.1 96.4,27.7 98.25,25.85 J5.22
N$26
  Top 0.305: C18.1 94.5,26.6 94.8,26.3 96.97,26.3 97.75,25.52 J5.23
N$27
  Top 0.305: J5.41 88.75,28.27 C20.1
N$28  (via drill 0.35)
  Top 0.305: v85.7,31.5 85.6,31.4 83.8,31.4 83.4,31 C22.2 | J5.42 88.25,21.75 v88.3,21.7
  Bottom 0.305: v85.7,31.5 86,31.2 86,21.3 86.5,20.8 88,20.8 88.3,21.1 v88.3,21.7
N$29
  Top 0.305: C22.1 83.4,26.7 83.7,26.4 86.2,26.4 87.75,24.85 J5.43
N$30  (via drill 0.35)
  Top 0.305: C23.1 v87,27 | J5.44 87.25,22.05 v86.9,21.7
  Bottom 0.305: v87,27 86.8,26.8 86.8,21.8 v86.9,21.7
N$31
  Top 0.305: 83.8,33.92 C21.2 82.12,33.92 80.6,32.4 80.6,28.1 82.36,26.34 82.85,25.85 83,25.7 86,25.7 86.75,24.95 J5.45
N$32
  Top 0.305: 83.17,35.67 C21.1 81.67,35.67 79.9,33.9 79.9,27.28 82.18,25 85.58,25 86.25,24.33 J5.46
N$34  (via drill 0.35)
  Top 0.305: C24.1 v85.2,27.2 | 82.8,23.85 82.53,24.12 84.08,24.12 84.25,23.95 J5.50 84.25,23.05 83.1,21.9 v82.9,21.9
  Bottom 0.305: v85.2,27.2 85.2,21.1 84.9,20.8 83.5,20.8 82.9,21.4 v82.9,21.9
N$35
  Top 0.305: 109.61,28.23 C10.1 109.7,26.6 108.57,25.47 108.05,24.95 107.75,24.65 J5.3
N$36
  Top 0.305: D5.1 103.81,40.31 104.35,40.85 U$3.1 109.05,40.85 111.05,38.85 Q1.3
N$37  (via drill 0.35)
  Top 0.305: Z1.1 115.65,28.6 | 115.5,29.2 Z1.1 | Q2.3 114.15,32.6 U$1.1 115.5,30.85 v115.5,29.7 Z1.1 | D6.2 88.1,37.85 88.1,39.27 C30.2 88.53,40.73 89.2,41.4 v97.9,41.4
  Bottom 0.305: v115.5,29.7 115.5,36.7 111.8,40.4 98.9,40.4 v97.9,41.4
N$38
  Top 0.406: 36.15,91.3 D4.1 36.46,91.61 Q6.2
N$39
  Top 0.203: U3.5 34.67,101.41 R21.2
N$40
  Top 0.203: U3.7 33.15,101.85 | 33.1,103.08 L3.1
  Top 0.254: U3.7 33.15,103.08 L3.1
N$41
  Top 0.406: IC5.1 37.06,74.95 R20.1
N$42
  Top 0.305: D8.2 90.4,39.58 C30.1 90.47,39.5 D7.1
N$43  (via drill 0.35)
  Top 0.508: IC5.3 36.1,62.48 H2.4 37.38,61.2 v32.2,61.2
  Bottom 0.508: v32.2,61.2 20.2,61.2 16.5,64.9 12.8,64.9 11.37,63.47 11.37,63.43 10.24,62.3 4.7,62.3 3.5,63.5 J3.1
N$45
  Top 0.203: U3.3 33.65,98.65 34.17,98.13 JP11.2
N$46
  Top 0.305: IC4.2 25.95,82.86 R24.2
N$47
  Top 0.305: R25.2 25.2,87.91 25.7,87.41 25.73,87.41 25.95,87.18 IC4.7
N$48
  Top 0.305: R26.2 26.1,87.7 26.45,87.35 IC4.6
N$50  (via drill 0.35)
  Top 0.203: 22.7,80.7 22.67,80.67 JP15.1
  Top 0.406: C50.1 v24.8,76 | R43.1 32.19,75.61 v31.8,76
  Top 1.016: 26.12,77.2 C49.1 23.4,78 | C50.1 26.12,77 26.12,77.1 26.12,77.2 | 23.4,78 D10.1 | JP15.1 22.67,78 | 22.67,78 23.4,78 | D10.1 26.12,77.2 | D10.1 22.67,77.2 22.67,78
  Top 1.27: C50.1 26.12,77 26.12,77.1 26.12,77.2 C49.1
  Bottom 0.406: v31.8,76 v24.8,76
N$56
  Top 0.305: IC4.1 25.45,83.95 24.7,83.2 C39.2 24.14,82.94 22.67,81.47 JP15.2
N$58
  Top 0.203: R34.1 53.77,82.99 IC1.3
N$60  (via drill 0.35)
  Top 0.2: R39.2 33.37,82.39 C42.2 C41.2 35.77,82.42 R40.1
  Top 0.305: R40.1 v35.8,80.9 | v39.4,84 39.5,84.1 JP29.1
  Bottom 0.305: v35.8,80.9 36.3,80.9 v39.4,84
N$62  (via drill 0.35)
  Top 0.203: LED1.1 72.3,91.4 v72.3,87.3 | R41.2 64.98,73.4 68.77,77.5 v71.5,77.5
  Bottom 0.203: v72.3,87.3 72.3,78.3 v71.5,77.5
N$63
  Top 1.27: H2.1 37.58,5.42 37,6 36.5,5.5 36.58,5.42 H2.2
N$64
  Top 1.27: H2.3 H1.4
N$65
  Top 0.203: R35.2 61.04,84.19 IC1.7
N$66
  Top 1.27: H1.2 H1.1
N$67
  Top 0.406: IC6.1 R7.2
N$68
  Top 0.406: C45.1 R7.1
N$69
  Top 0.406: 25.77,74 IC6.5 23.43,73.97 D10.2
  Top 0.61: D10.2 21.5,74 21.25,73.75 21.25,72.62 U$2.2
N$70  (via drill 0.35)
  Top 0.406: C48.1 v30.7,68.7 | v24.9,71.2 24.9,71.7 25.23,72.03 IC6.8
  Bottom 0.406: v30.7,68.7 27.4,68.7 v24.9,71.2
N$71
  Top 0.406: IC6.2 30.23,72.7 R42.1 32.79,73.58 R43.2
REG_EN
  Top 0.203: U3.4 R22.2
REG_IN  (via drill 0.35)
  Top 0.254: U3.2 33.15,98.75 32.67,98.28 C37.2
  Top 0.305: R22.1 35.5,98.1 v35.9,97.7
  Top 0.406: v32.6,96 32.6,97.42 C37.2 | v32.6,96 35.05,96 Q6.3 | 32.39,94.31 32.39,95.79 v32.6,96 | 32.39,94.31 D13.1 | C36.2 30.93,94.03 31.21,94.31 32.39,94.31
  Bottom 0.305: v35.9,97.7 34.3,97.7 v32.6,96
USB_CC1  (via drill 0.35)
  Top 0.2: U2.1 21.24,102.4 v22.24,101.4 22.24,101.24
  Top 0.203: J1.A5 19.49,94.96 v18.8,95.65
  Bottom 0.2: v18.8,95.65 19.75,95.65 21.4,97.3 21.4,98.41 20.94,98.86 20.94,100.06 22.24,101.36 v22.24,101.4
USB_CC2  (via drill 0.35)
  Top 0.2: J1.B5 24,96.46 25.46,96.46 v25.5,96.5 | v23.44,101.34 21.64,103.15 U2.2
  Bottom 0.2: v23.44,101.34 v23.45,101.34 23.84,100.96 23.84,98.86 23.2,98.22 23.2,97.3 24,96.5 v25.5,96.5
USB_DN  (via drill 0.35)
  Top 0.2: v25.6,91.2 23.76,89.36 D2.2 | J1.B7 22.74,95.46 22.24,95.96 J1.A7
  Top 0.203: D2.2 21.2,86.54 v21.2,80.4 | J1.B7 23.84,95.46 24,95.3 24,94.5 24.2,94.3 25.1,94.3 25.26,94.45 v25.65,94.45 | TP3.TP 74.22,95.4 79.5,95.4 80.5,94.4 80.5,91.5 66.8,77.8 v45.3,77.8
  Top 0.305: IC2.5 74.2,98.8 73.62,98.22 TP3.TP
  Bottom 0.2: v25.6,91.2 25.9,91.5 25.9,93.4 25.9,93.62
  Bottom 0.203: v21.2,80.4 22.2,79.4 43.2,79.4 44.8,77.8 v45.3,77.8 | 25.9,93.4 25.9,94.2 v25.65,94.45
USB_DP  (via drill 0.35)
  Top 0.2: 24,95.96 J1.B6 | D1.2 19.1,89.1 18.9,89.3 v18.9,91.8 18.1,92.6 18.1,95.94 18.54,96.38
  Top 0.203: D1.2 19.44,80.66 v21.2,78.9 | TP4.TP 72.4,95.6 73.1,94.9 79.3,94.9 80,94.2 80,91.58 66.62,78.2 47.1,78.2 46.2,79.1 43.1,79.1 v42.6,78.6 | J1.A6 20.84,95.46 20.7,95.6 20.7,96.3 20.5,96.5 18.66,96.5 18.54,96.38 | 24,95.96 24.4,95.56 24.4,94.8 24.5,94.7 24.9,94.7 25.6,95.4 v25.6,95.5
  Top 0.305: IC2.4 73.7,99.1 72.4,97.8 TP4.TP
  Bottom 0.2: 24.6,95.83 23.83,95.83 22.4,94.4 22.4,94 21.81,93.41 21.79,93.41 20.18,91.8 v18.9,91.8
  Bottom 0.203: v21.2,78.9 21.5,78.6 v42.6,78.6 | v25.6,95.5 25.27,95.83 24.6,95.83
USBCC_INT
  Top 0.2: 37.1,105.6 37,105.7 37,108 35.86,109.14 32.94,109.14
  Top 0.203: U2.6 22.19,106.99 24.34,109.14 32.94,109.14 | 37.1,105.6 JP12.1
USBCC_SCL
  Top 0.2: 38.98,105.92 38,106.9 38,109 36.4,110.6 24.4,110.6 23.9,110.1 | 21.24,107.1 21.23,107.11 | R12.2 21.24,106.1
  Top 0.203: JP5.1 38.98,105.92 | U2.8 21.24,106.1 21.24,107.1 21.24,107.44 23.9,110.1 24.2,110.4
USBCC_SDA  (via drill 0.35)
  Top 0.2: 24.37,109.87 v25.5,109.87 36.43,109.87 37.5,108.8 37.5,106.3 | R10.2 19.9,101.99 18.3,103.59 18.3,106.7 21.5,109.9 v21.9,109.9
  Top 0.203: JP4.1 39.5,104.3 37.5,106.3 | U2.7 21.64,107.14 24.37,109.87
  Bottom 0.2: v25.5,109.87 21.93,109.87 v21.9,109.9

## Text on the board
silk_top_opt: UART | . | . | POWER | . | . | . | . | MCU | . | . | ACC | . | . | 1 ESP_P13 / 2 ESP_P12 / 3 ESP_MISO (P5) / 4 ESP_MOSI (P4) / 5 ESP_CLK (P15) / 6 3V3 / 7 GND | . | JST B7B-PH-SM4-TB(LF)(SN) / JLC: C495700 | CHARGER | . | FLASH | BUTTON / LED | - | + | DISPLAY | . | . | . | . | . | www.paperlesspaper.de